# EasyEDA schematic Schematic_Diagram.json
TITLE: Sheet_1; REV: 1.0; Date: 2025-05-27; Sheet: 1/1; Drawn By: dipanjan33; Company: Team_X
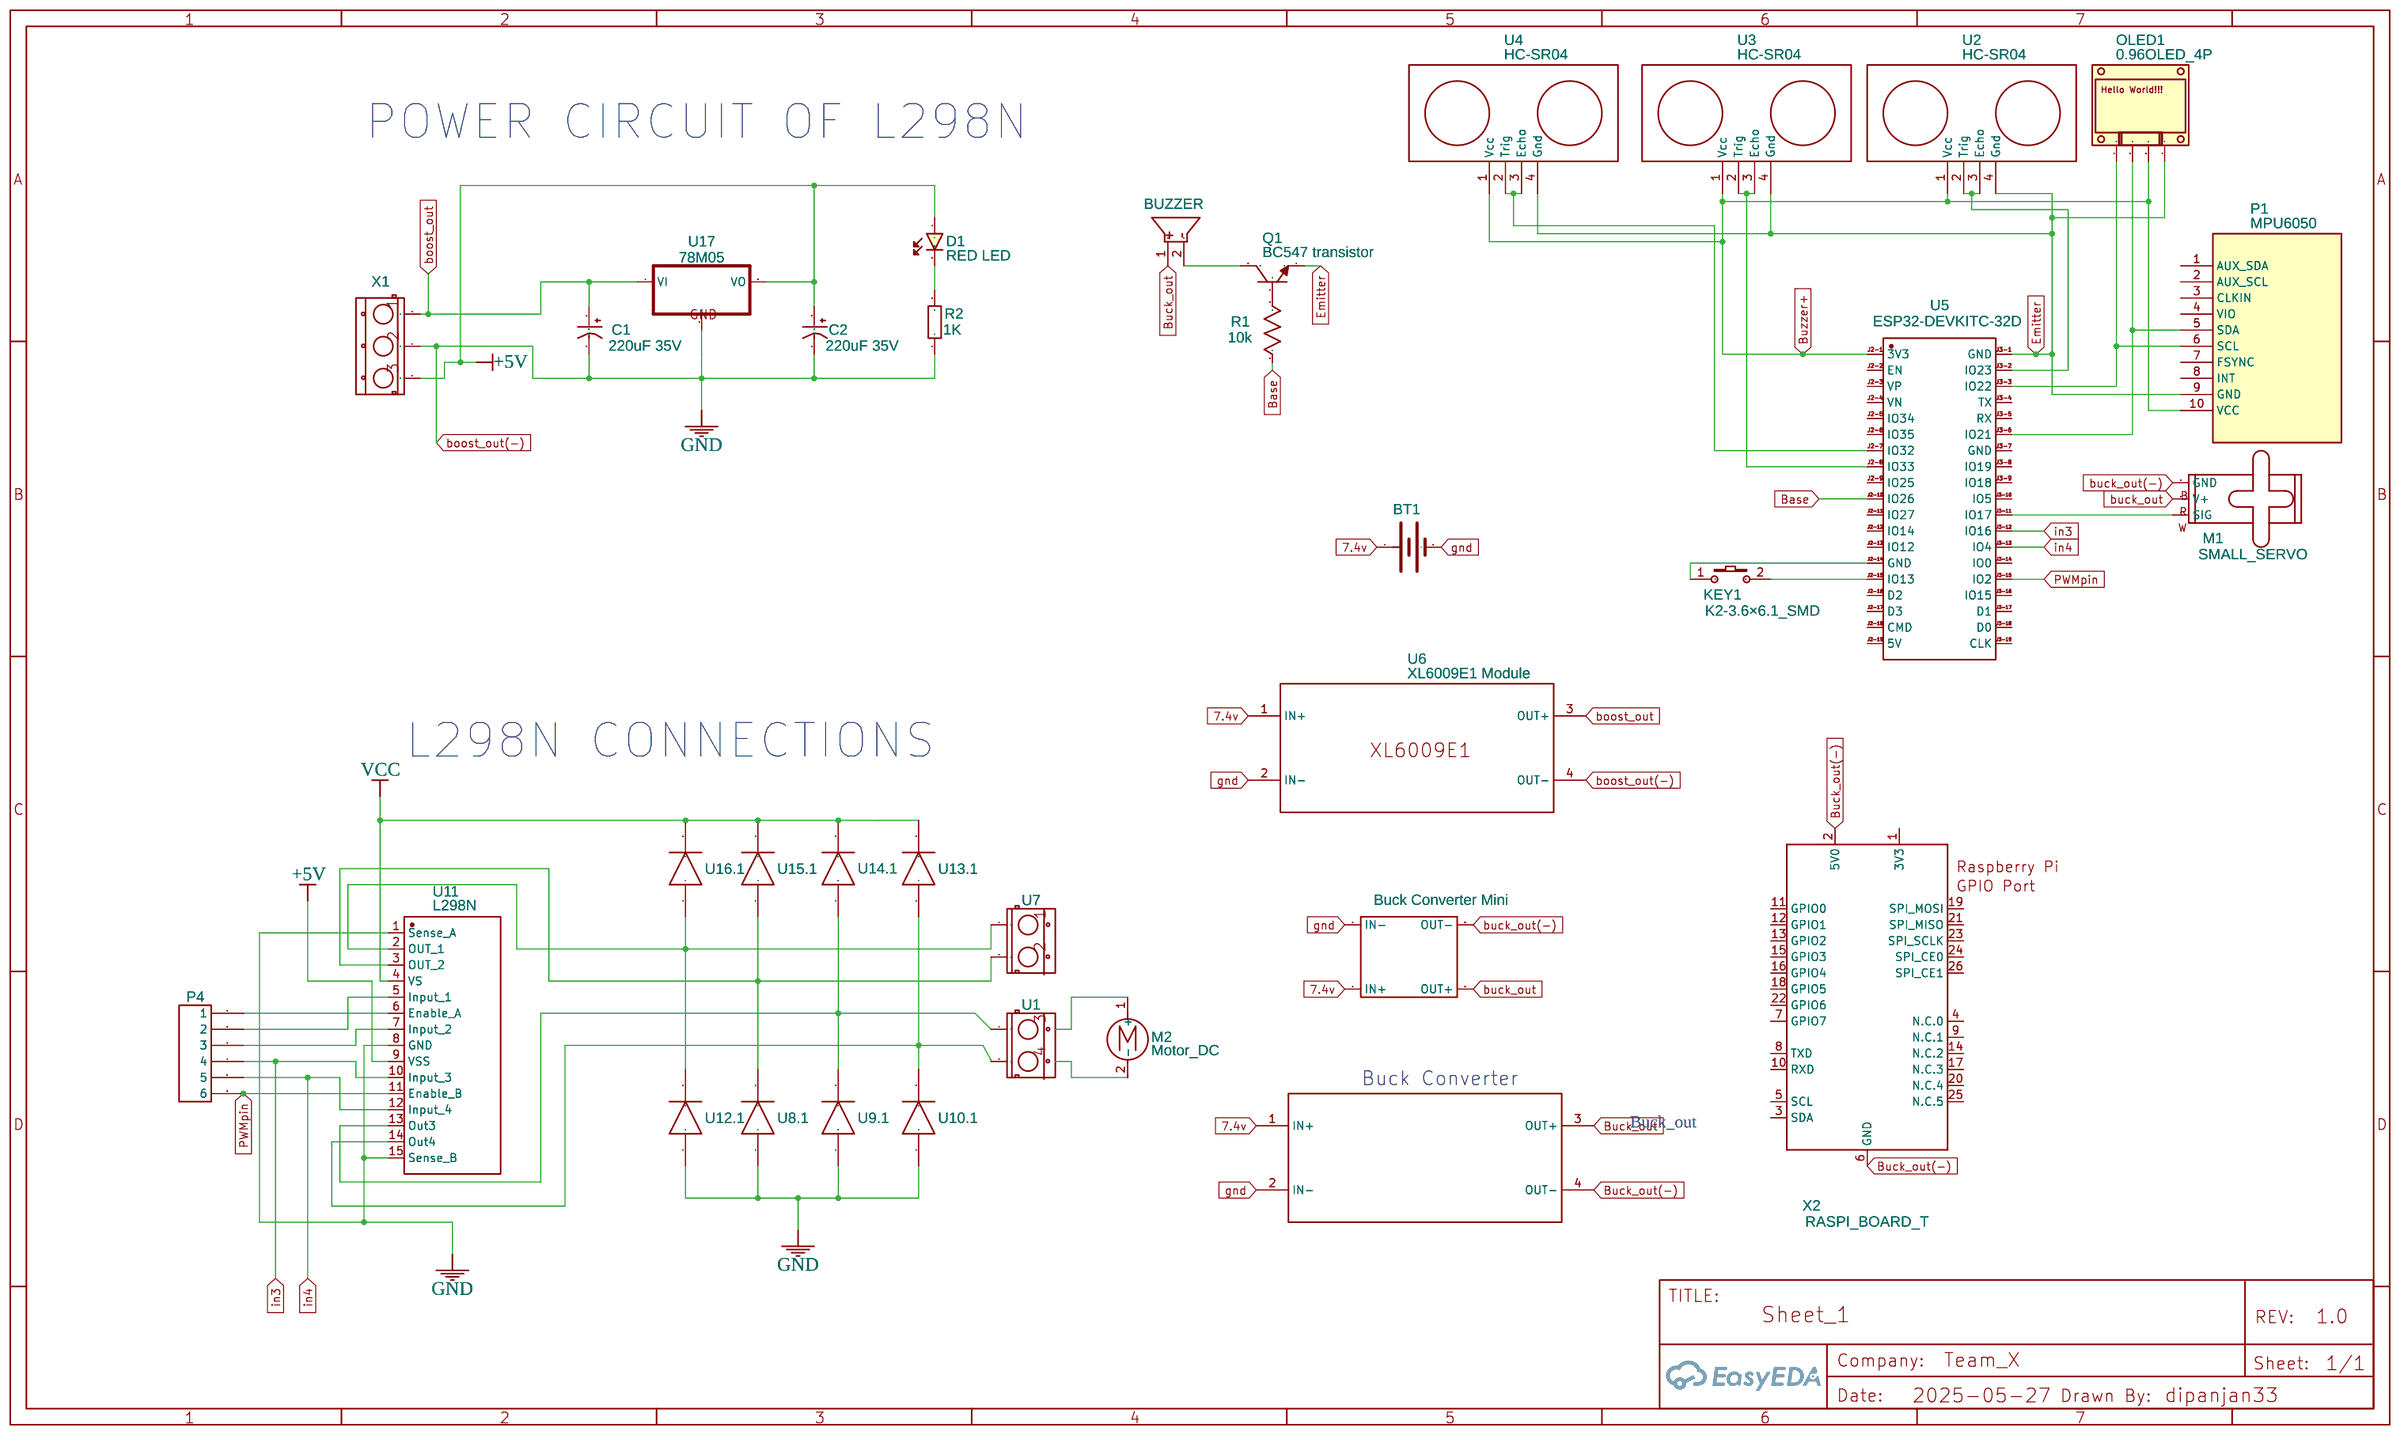
[diagram p0: schematic sheet]

## Parts
1  Buck Converter Mini  [DC-DC-STEP-DOWN-LM2596]
BT1  7.4V电池铜线扣 铜100MM  [BAT-TH_2P-9VBATTERY]
BUZZER  FMQ-BUZZER2  [BUZ-TH_BD12.0-P7.60-D0.6-FD]
C1  220uF 35V  [CC6.56.5]
C2  220uF 35V  [CC6.56.5]
D1  RED LED  [0603 LED 0.8]
KEY1  K2-3.6×6.1_SMD  [KEY-SMD_2P-L6.2-W3.6-LS8.0]
M1  SMALL_SERVO  [1X03]
M2  Motor_DC  [CONN-TH_2P-P5.08]
OLED1  0.96OLED_4P  [0.96OLED_4P]
P1  MPU6050  [MPU6050]
P4  male header 1*6p NO MASK  [HDR-6X1/2.54 NO MASK]
Q1  BC547 transistor  [SOT-23-3_L2.9-W1.3-P1.90-LS2.4-TR]
R1  10k  [R0603]
R2  1K  [0603 RES]
U1  KF301-2P  [KF301-2P]
U2  HC-SR04  [HCSR04]
U3  HC-SR04  [HCSR04]
U4  HC-SR04  [HCSR04]
U5  ESP32-DEVKITC-32D  [COMM-SMD_ESP32-DEVKITC-32D]
U6  XL6009E1 Module  [XL6009E1 MODULE]
U7  KF301-2P  [KF301-2P]
U8  1N4001 M1 SMD  [1N4001 M1 SMD]  (section 1)
U9  1N4001 M1 SMD  [1N4001 M1 SMD]  (section 1)
U10  1N4001 M1 SMD  [1N4001 M1 SMD]  (section 1)
U11  L298N  [L298N WITH FIXED PINS]
U12  1N4001 M1 SMD  [1N4001 M1 SMD]  (section 1)
U13  1N4001 M1 SMD  [1N4001 M1 SMD]  (section 1)
U14  1N4001 M1 SMD  [1N4001 M1 SMD]  (section 1)
U15  1N4001 M1 SMD  [1N4001 M1 SMD]  (section 1)
U16  1N4001 M1 SMD  [1N4001 M1 SMD]  (section 1)
U17  78M05  [78M05]
U18  XL6009E1 Module  [XL6009E1 MODULE]
X1  KF301-3P  [KF301-3P]
X2  RASPI_BOARD_T  [RASPI_BOARD_THIN]

## Library data of the parts
1 = DC STEP DOWN_SUPER MINI: Contributor: adicahyono; Manufacturer Part: LM2596; Supplier Part: CNC Store Bandung; Manufacturer: Calibrate; link: https://shopee.co.id/SUPER-MINI-360-ULTRA-SMALL-ADJUSTABLE-DC-STEP-DOWN-LM2596-2A-5V-23V-TO-1V-17V-MODULE-i.62956347.6813264763
BT1 = 9V电池铜线扣 铜100MM: Supplier: LCSC; Supplier Part: C70374; Manufacturer: Q&J; Manufacturer Part: 9V电池铜线扣 铜100mm; JLCPCB Part Class: Extended Part; Contributor: lcsc
BUZZER = FMQ-BUZZER2: Contributor: LCSC; Supplier: LCSC; Supplier Part: C9900006103; JLCPCB Part Class: Extended Part; Manufacturer: null
C1 C2 = CAP
D1 = 0603 LED: Contributor: Gerwin
KEY1 = K2-3.6×6.1_SMD: Supplier Part: C118141; Supplier: LCSC; Manufacturer Part: K2-1107ST-A4SW-06; Contributor: LCEDA_Lib; 制造商: 韩国韩荣
M1 = SMALL_SERVO: Small servo motor; Contributor: SparkFun
M2 = Motor_DC: Contributor: KiCAD; license: https://www.gnu.org/licenses/lgpl-2.1.html
OLED1 = 0.96OLED_4P: Supplier: LCSC; Contributor: LCEDA_Lib
P1 = MPU6050: sourceId: 1T5FDZYC8
P4 = male header 1*6p NO MASK: Supplier Part: C40877; Supplier: LCSC; Manufacturer: BOOMELE; Manufacturer Part: Female header 1*6p
Q1 = 2N3904(SOT-23): Supplier: LCSC; Manufacturer: KEC; Manufacturer Part: 2n3904S-RTK/PS; Supplier Part: C18536; Paste Type: SOT-23; Contributor: LCEDA_Lib
R1 = R_0603_US: Contributor: LCEDA_Lib
R2 = 0603 res: Contributor: wawa1474
U1 U7 = KF301-2P: Contributor: vonk0031; sourceId: C42oKHrpn
U2-U4 = HC-SR04: Contributor: torpill40
U5 = ESP32-DEVKITC-32D: Supplier: LCSC; Supplier Part: C571181; Manufacturer: ESPRESSIF(乐鑫); Manufacturer Part: ESP32-DevKitC-32D; JLCPCB Part Class: Extended Part; Contributor: lcsc
U6 U18 = XL6009E1 Module: Contributor: khubua
U8-U10 U12-U16 = 1N4001 M1 SMD: Supplier: FlareBright; Contributor: FlareBright; subpart_no: 1
U11 = L298N: sourceId: HXUgCYWig; Supplier: LCSC; Manufacturer: STMicroelectronics; image: //image.lceda.cn/szlcsc/C19922.jpg; Supplier Part: C19922; Contributor: DannyHallo
U17 = 78M05: Positive VOLTAGE REGULATOR; Contributor: matko123
X1 = KF301-3P: Contributor: vonk0031; sourceId: v3fqomWw6
X2 = RASPI_BOARD_T

## Nets
7.4v: 1.IN+ BT1.1(+) U6.1(IN+) U18.1(IN+)
+5V: C2.1(VCC) D1.A U11.9(VSS) U17.2(VO) X1.3
gnd: 1.IN- BT1.2(-) U6.2(IN-) U18.2(IN-)
GND: C1.2(GND) C2.2(GND) R2.1 U6.4(OUT-) U8.1 U9.1 U10.1 U11.1(Sense A) U11.8(GND) U11.15(Sense B) U12.1 U17.3(GND) X1.2
VCC: U11.4(VS) U13.2 U14.2 U15.2 U16.2
Base: R1.1 U5.J2-10(IO26)
boost_out: C1.1(VCC) U6.3(OUT+) U17.1(VI) X1.1
buck_out: 1.OUT+ M1.2(V+)
Buck_out: BUZZER.1 U18.3(OUT+)
buck_out(-): 1.OUT- M1.3(GND)
Buck_out(-): U18.4(OUT-) X2.2(5V0) X2.6(GND)
Buzzer+: OLED1.3 P1.10(VCC) U2.1(Vcc) U3.1(Vcc) U4.1(Vcc) U5.J2-1(3V3)
Emitter: OLED1.4 P1.9(GND) Q1.1(E) U2.4(Gnd) U3.4(Gnd) U4.4(Gnd) U5.J3-1(GND)
in3: P4.4 U5.J3-12(IO16) U11.10(Input 3)
in4: P4.5 U5.J3-13(IO4) U11.12(Input 4)
PWMpin: P4.6 U5.J3-15(IO2) U11.11(Enable B)
Net-(BUZZER-2): BUZZER.2 Q1.3(C)
Net-(D1-C): D1.C R2.2
Net-(KEY1-1): KEY1.1 U5.J2-14(GND)
Net-(KEY1-2): KEY1.2 U5.J2-15(IO13)
Net-(M1-1): M1.1(SIG) U5.J3-11(IO17)
Net-(OLED1-1): OLED1.1 P1.6(SCL) U5.J3-3(IO22)
Net-(OLED1-2): OLED1.2 P1.5(SDA) U5.J3-6(IO21)
Net-(P4-1): P4.1 U11.6(Enable A)
Net-(P4-2): P4.2 U11.5(Input 1)
Net-(P4-3): P4.3 U11.7(Input 2)
Net-(Q1-2): Q1.2(B) R1.2
Net-(U1-1): U1.1 U9.2 U11.13(Out3) U14.1
Net-(U1-2): U1.2 U10.2 U11.14(Out4) U13.1
Net-(U2-2): U2.2(Trig) U2.3(Echo) U5.J3-2(IO23)
Net-(U3-2): U3.2(Trig) U3.3(Echo) U5.J2-8(IO33)
Net-(U4-2): U4.2(Trig) U4.3(Echo) U5.J2-7(IO32)
Net-(U7-1): U7.1 U11.2(OUT 1) U12.2 U16.1
Net-(U7-2): U7.2 U8.2 U11.3(OUT 2) U15.1

Not connected (* = marked no-connect by the designer): M2 1(+) 2(-); P1 1(AUX_SDA) 2(AUX_SCL) 3(CLKIN) 4(VIO) 7(FSYNC) 8(INT); U5 J2-2(EN) J2-3(VP) J2-4(VN) J2-5(IO34) J2-6(IO35) J2-9(IO25) J2-11(IO27) J2-12(IO14) J2-13(IO12) J2-16(D2) J2-17(D3) J2-18(CMD) J2-19(5V) J3-4(TX) J3-5(RX) J3-7(GND) J3-8(IO19) J3-9(IO18) J3-10(IO5) J3-14(IO0) J3-16(IO15) J3-17(D1) J3-18(D0) J3-19(CLK); X2 1(3V3) 3(SDA) 4(N.C.0) 5(SCL) 7(GPIO7) 8(TXD) 9(N.C.1) 10(RXD) 11(GPIO0) 12(GPIO1) 13(GPIO2) 14(N.C.2) 15(GPIO3) 16(GPIO4) 17(N.C.3) 18(GPIO5) 19(SPI_MOSI) 20(N.C.4) 21(SPI_MISO) 22(GPIO6) 23(SPI_SCLK) 24(SPI_CE0) 25(N.C.5) 26(SPI_CE1)

## Notes on the sheet
- POWER CIRCUIT OF L298N
- L298N CONNECTIONS
- Buck Converter
- Buck_out
